# EAGLE design FlightComputer_DeploymentBoard_Rev_B (EAGLE 9.0.1)
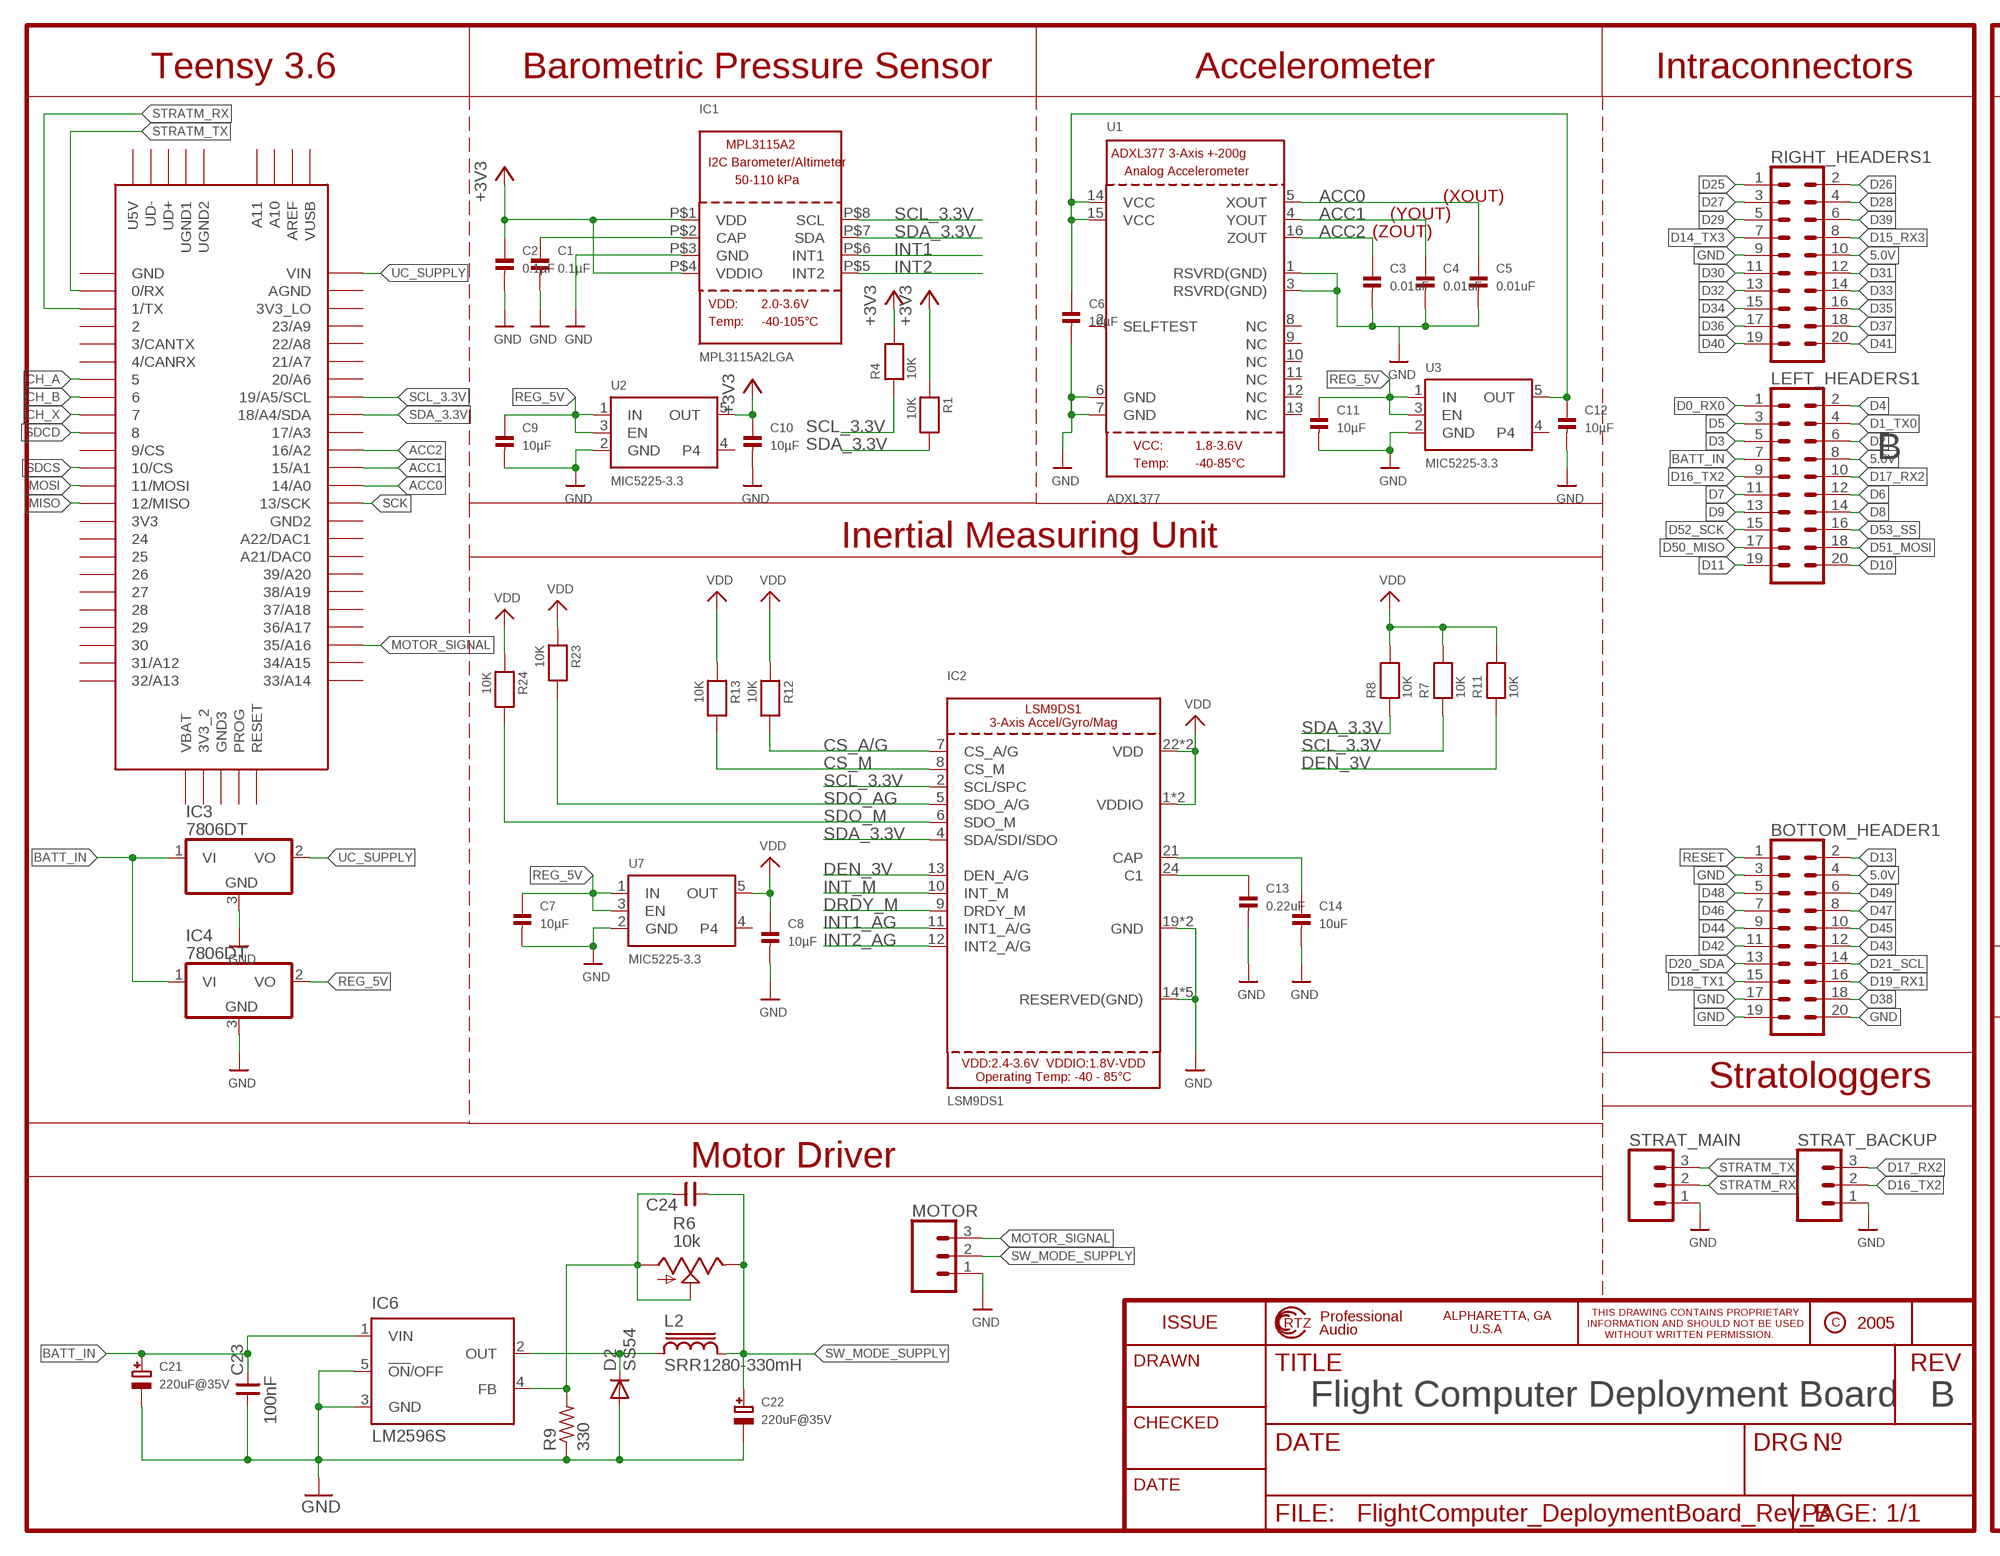
[diagram p0: schematic, sheet 1, part 1 of 2]
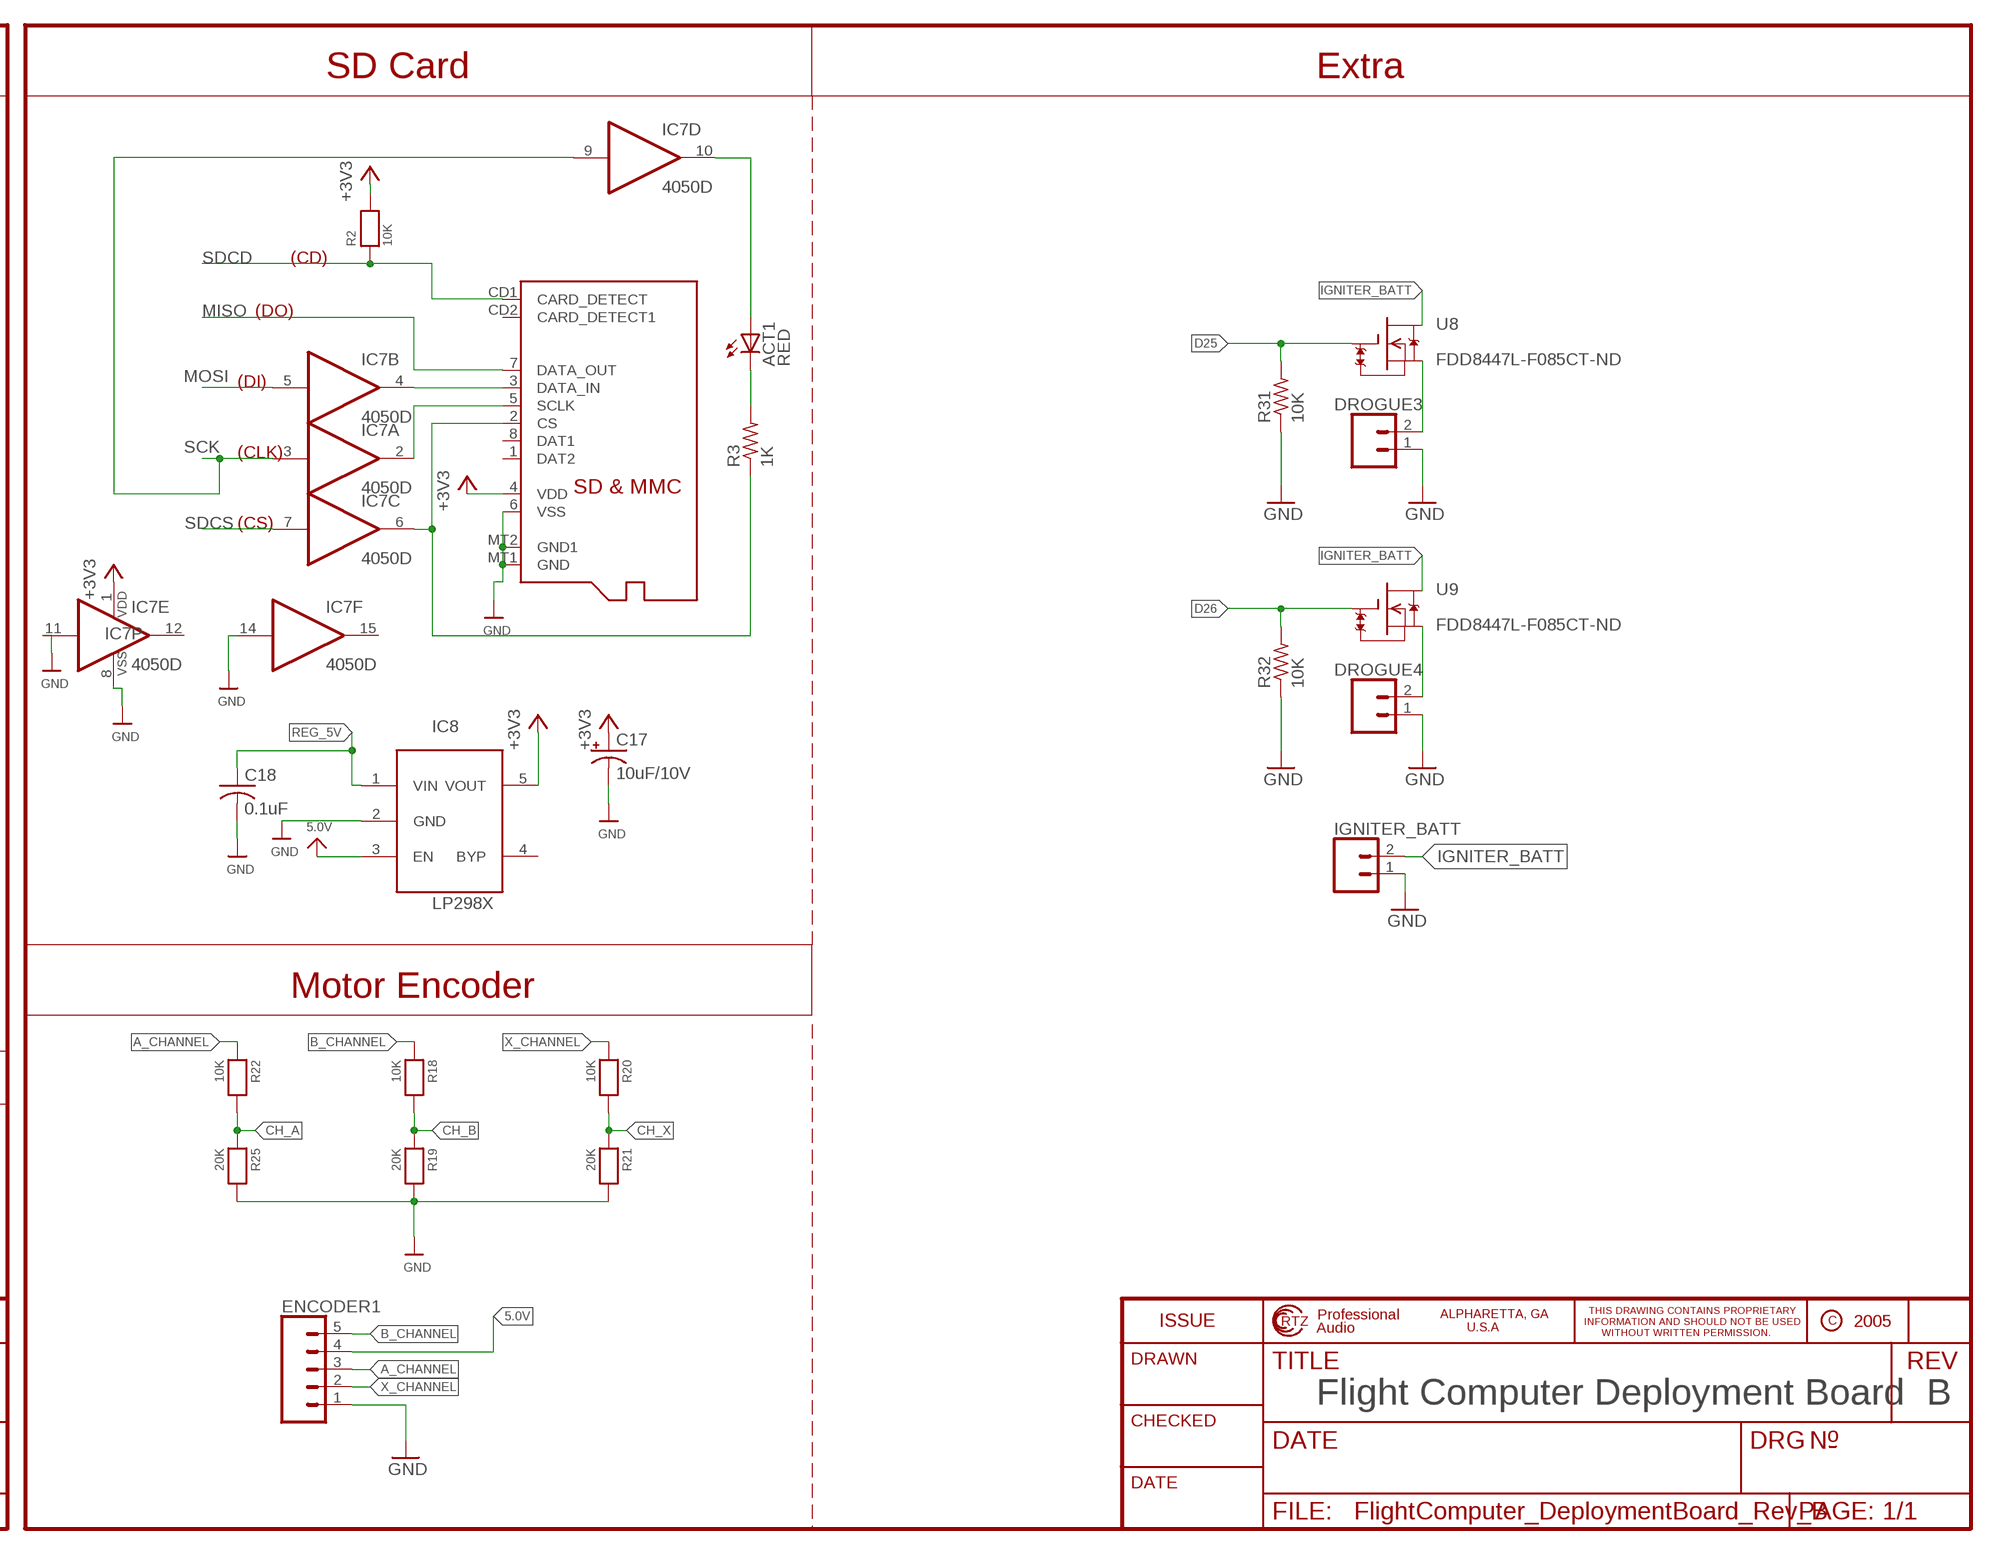
[diagram p1: schematic, sheet 1, part 2 of 2]

## Parts
ACT1  RED  LEDCHIP-LED0805  [CHIP-LED0805]
BOTTOM_HEADER1  CONN_10X2  [2X10]
C1  0.1µF  CAP_CERAMIC0603  [0603]
C2  0.1µF  CAP_CERAMIC0603  [0603]
C3  0.01uF  CAP_CERAMIC0603  [0603]
C4  0.01uF  CAP_CERAMIC0603  [0603]
C5  0.01uF  CAP_CERAMIC0603  [0603]
C6  10µF  CAP_CERAMIC0603  [0603]
C7  10µF  CAP_CERAMIC0603  [0603]
C8  10µF  CAP_CERAMIC0603  [0603]
C9  10µF  CAP_CERAMIC0603  [0603]
C10  10µF  CAP_CERAMIC0603  [0603]
C11  10µF  CAP_CERAMIC0603  [0603]
C12  10µF  CAP_CERAMIC0603  [0603]
C13  0.22uF  CAP_CERAMIC0603  [0603]
C14  10uF  CAP_CERAMIC0603  [0603]
C17  10uF/10V  CPOL-USA/3216-18R  [A/3216-18R]
C18  0.1uF  C-USC0805K  [C0805K]
C21  220uF@35V  CAP_ELECTROLYTICPANASONIC_D  [PANASONIC_D]
C22  220uF@35V  CAP_ELECTROLYTICPANASONIC_D  [PANASONIC_D]
C23  100nF  CNP-0603  [0603]
C24  CNP-0603  [0603]
D2  SS54  S3G  [DO214AB]
DROGUE3  CONN_023.5MM  [SCREWTERMINAL-3.5MM-2]
DROGUE4  CONN_023.5MM  [SCREWTERMINAL-3.5MM-2]
ENCODER1  CONN_05  [1X05]
IC1  MPL3115A2LGA  [LGA8]
IC2  LSM9DS1  [LGA24_3.5X3.1MM]
IC3  7806DT  [TO252]
IC4  7806DT  [TO252]
IC6  LM2596S  [TO263-5]
IC7  4050D  [SO16]
IC8  LP298XS  [SOT23-5L]
IGNITER_BATT  CONN_02  [1X02]
L2  SRR1280-330mH  SRR1280  [SRR1280]
LEFT_HEADERS1  CONN_10X2  [2X10]
MOTOR  CONN_03  [1X03]
R1  10K  RESISTOR0603  [0603]
R2  10K  RESISTOR0603  [0603]
R3  1K  R-US_R0805  [R0805]
R4  10K  RESISTOR0603  [0603]
R6  10k  TRIM_US-S64W  [S64W]
R7  10K  RESISTOR0603  [0603]
R8  10K  RESISTOR0603  [0603]
R9  330  R-US_R0603  [R0603]
R11  10K  RESISTOR0603  [0603]
R12  10K  RESISTOR0603  [0603]
R13  10K  RESISTOR0603  [0603]
R18  10K  RESISTOR0603  [0603]
R19  20K  RESISTOR0603  [0603]
R20  10K  RESISTOR0603  [0603]
R21  20K  RESISTOR0603  [0603]
R22  10K  RESISTOR0603  [0603]
R23  10K  RESISTOR0603  [0603]
R24  10K  RESISTOR0603  [0603]
R25  20K  RESISTOR0603  [0603]
R31  10K  R-US_R0805  [R0805]
R32  10K  R-US_R0805  [R0805]
RIGHT_HEADERS1  CONN_10X2  [2X10]
STRAT_BACKUP  CONN_03  [1X03]
STRAT_MAIN  CONN_03  [1X03]
U1  ADXL377  ACCEL_ADXL377  [LFCSP16_LQ]
U2  MIC5225-3.3  VREG_SOT23-5  [SOT23-5]
U3  MIC5225-3.3  VREG_SOT23-5  [SOT23-5]
U7  MIC5225-3.3  VREG_SOT23-5  [SOT23-5]
U8  FDD8447L-F085CT-ND  TSM4ND50  [TO252]
U9  FDD8447L-F085CT-ND  TSM4ND50  [TO252]
U$1  TEENSY_3.5/3.6  [TEENSY_3.5/3.6]
U$38  STRATOLOGGER  [STRATOLOGGER]
X2  MICROSD  [MICROSD]

## Nets
5.0V: BOTTOM_HEADER1.4 ENCODER1.4 IC8.3(EN) LEFT_HEADERS1.8 RIGHT_HEADERS1.10
+3V3: C2.1 C10.1 C17.+ IC1.P$1(VDD) IC1.P$4(VDDIO) IC7.1(P:VDD) IC8.5(VOUT) R1.1 R2.2 R4.2 U2.5(OUT) X2.4(VDD)
A_CHANNEL: ENCODER1.3 R22.1
ACC0: C5.1 U1.5(XOUT) U$1.14/A0
ACC1: C4.1 U1.4(YOUT) U$1.15/A1
ACC2: C3.1 U1.16(ZOUT) U$1.16/A2
B_CHANNEL: ENCODER1.5 R18.1
BATT_IN: C21.+ C23.2 IC3.1(VI) IC4.1(VI) IC6.1(VIN) LEFT_HEADERS1.7
C1: C13.1 IC2.24(C1)
CAP1: C1.1 IC1.P$2(CAP)
CAP3: C14.1 IC2.21(CAP)
CH_A: R22.2 R25.1 U$1.5
CH_B: R18.2 R19.1 U$1.6
CH_X: R20.2 R21.1 U$1.7
CS_A/G: IC2.7(CS_A/G) R12.2
CS_M: IC2.8(CS_M) R13.2
D0_RX0: LEFT_HEADERS1.1
D1_TX0: LEFT_HEADERS1.4
D2: LEFT_HEADERS1.6
D3: LEFT_HEADERS1.5
D4: LEFT_HEADERS1.2
D5: LEFT_HEADERS1.3
D6: LEFT_HEADERS1.12
D7: LEFT_HEADERS1.11
D8: LEFT_HEADERS1.14
D9: LEFT_HEADERS1.13
D10: LEFT_HEADERS1.20
D11: LEFT_HEADERS1.19
D13: BOTTOM_HEADER1.2
D14_TX3: RIGHT_HEADERS1.7
D15_RX3: RIGHT_HEADERS1.8
D16_TX2: LEFT_HEADERS1.9 STRAT_BACKUP.2
D17_RX2: LEFT_HEADERS1.10 STRAT_BACKUP.3
D18_TX1: BOTTOM_HEADER1.15
D19_RX1: BOTTOM_HEADER1.16
D20_SDA: BOTTOM_HEADER1.13
D21_SCL: BOTTOM_HEADER1.14
D25: R31.2 RIGHT_HEADERS1.1 U8.G
D26: R32.2 RIGHT_HEADERS1.2 U9.G
D27: RIGHT_HEADERS1.3
D28: RIGHT_HEADERS1.4
D29: RIGHT_HEADERS1.5
D30: RIGHT_HEADERS1.11
D31: RIGHT_HEADERS1.12
D32: RIGHT_HEADERS1.13
D33: RIGHT_HEADERS1.14
D34: RIGHT_HEADERS1.15
D35: RIGHT_HEADERS1.16
D36: RIGHT_HEADERS1.17
D37: RIGHT_HEADERS1.18
D38: BOTTOM_HEADER1.18
D39: RIGHT_HEADERS1.6
D40: RIGHT_HEADERS1.19
D41: RIGHT_HEADERS1.20
D42: BOTTOM_HEADER1.11
D43: BOTTOM_HEADER1.12
D44: BOTTOM_HEADER1.9
D45: BOTTOM_HEADER1.10
D46: BOTTOM_HEADER1.7
D47: BOTTOM_HEADER1.8
D48: BOTTOM_HEADER1.5
D49: BOTTOM_HEADER1.6
D50_MISO: LEFT_HEADERS1.17
D51_MOSI: LEFT_HEADERS1.18
D52_SCK: LEFT_HEADERS1.15
D53_SS: LEFT_HEADERS1.16
DEN_3V: IC2.13(DEN_A/G) R11.1
DRDY_M: IC2.9(DRDY_M)
GND: BOTTOM_HEADER1.3 BOTTOM_HEADER1.17 BOTTOM_HEADER1.19 BOTTOM_HEADER1.20 C1.2 C2.2 C3.2 C4.2 C5.2 C6.2 C7.2 C8.2 C9.2 C10.2 C11.2 C12.2 C13.2 C14.2 C17.- C18.2 C21.- C22.- C23.1 D2.A DROGUE3.1 DROGUE4.1 ENCODER1.1 IC1.P$3(GND) IC2.14(RESERVED(GND)) IC2.15(RESERVED(GND)) IC2.16(RESERVED(GND)) IC2.17(RESERVED(GND)) IC2.18(RESERVED(GND)) IC2.19(GND) IC2.20(GND) IC3.3(GND) IC4.3(GND) IC6.3(GND) IC6.5(!ON!/OFF) IC7.8(P:VSS) IC7.11(E:I) IC7.14(F:I) IC8.2(GND) IGNITER_BATT.1 MOTOR.1 R9.1 R19.2 R21.2 R25.2 R31.1 R32.1 RIGHT_HEADERS1.9 STRAT_BACKUP.1 STRAT_MAIN.1 U1.1(RSVRD(GND)) U1.3(RSVRD(GND)) U1.6(GND) U1.7(GND) U2.2(GND) U3.2(GND) U7.2(GND) X2.6(VSS) X2.MT1(GND) X2.MT2(GND1)
IGNITER_BATT: IGNITER_BATT.2 U8.D U9.D
INT1: IC1.P$6(INT1)
INT1_AG: IC2.11(INT1_A/G)
INT2: IC1.P$5(INT2)
INT2_AG: IC2.12(INT2_A/G)
INT_M: IC2.10(INT_M)
MISO: U$1.12/MISO X2.7(DATA_OUT)
MOSI: IC7.5(B:I) U$1.11/MOSI
MOTOR_SIGNAL: MOTOR.3 U$1.35/A16
N$1: ACT1.A IC7.10(D:O)
N$2: IC7.2(A:O) X2.5(SCLK)
N$4: IC7.6(C:O) R3.1 X2.2(CS)
N$5: ACT1.C R3.2
N$6: IC7.4(B:O) X2.3(DATA_IN)
N$8: D2.C IC6.2(OUT) L2.1
N$9: C24.2 IC6.4(FB) R6.A R6.S R9.2
N$36: C6.1 C12.1 U1.14(VCC) U1.15(VCC) U3.5(OUT)
REG_5V: C7.1 C9.1 C11.1 C18.1 IC4.2(VO) IC8.1(VIN) U2.1(IN) U2.3(EN) U3.1(IN) U3.3(EN) U7.1(IN) U7.3(EN)
RESET: BOTTOM_HEADER1.1
SCK: IC7.3(A:I) IC7.9(D:I) U$1.13/SCK
SCL_3.3V: IC1.P$8(SCL) IC2.2(SCL/SPC) R4.1 R7.1 U$1.19/A5/SCL
SDA_3.3V: IC1.P$7(SDA) IC2.4(SDA/SDI/SDO) R1.2 R8.1 U$1.18/A4/SDA
SDCD: R2.1 U$1.8 X2.CD1(CARD_DETECT)
SDCS: IC7.7(C:I) U$1.10/CS
SDO_AG: IC2.5(SDO_A/G) R23.2
SDO_M: IC2.6(SDO_M) R24.2
SOURCE2: DROGUE3.2 U8.S
SOURCE3: DROGUE4.2 U9.S
STRATM_RX: STRAT_MAIN.2 U$1.1/TX
STRATM_TX: STRAT_MAIN.3 U$1.0/RX
SW_MODE_SUPPLY: C22.+ C24.1 L2.2 MOTOR.2 R6.E
UC_SUPPLY: IC3.2(VO) U$1.VIN
VDD: C8.1 IC2.1(VDDIO) IC2.3(VDDIO) IC2.22(VDD) IC2.23(VDD) R7.2 R8.2 R11.2 R12.1 R13.1 R23.1 R24.1 U7.5(OUT)
X_CHANNEL: ENCODER1.2 R20.1
Unconnected: IC7.12(E:O) IC7.15(F:O) IC8.4(BYP) U1.2(SELFTEST) U1.8(NC) U1.9(NC) U1.10(NC) U1.11(NC) U1.12(NC) U1.13(NC) U2.4 U3.4 U7.4 U$1.2 U$1.3/CANTX U$1.3V3 U$1.3V3_2 U$1.3V3_LO U$1.4/CANRX U$1.9/CS U$1.17/A3 U$1.20/A6 U$1.21/A7 U$1.21/DAC0(A21/DAC0) U$1.22/A8 U$1.23/A9 U$1.24 U$1.25 U$1.26 U$1.27 U$1.28 U$1.29 U$1.30 U$1.31/A12 U$1.32/A13 U$1.33/A14 U$1.34/A15 U$1.36/A17 U$1.37/A18 U$1.38/A19 U$1.39/A20 U$1.A10 U$1.A11 U$1.A22/DAC1 U$1.AGND U$1.AREF U$1.GND U$1.GND2 U$1.GND3 U$1.PROG U$1.RESET U$1.U5V U$1.UD+ U$1.UD- U$1.UGND1 U$1.UGND2 U$1.VBAT U$1.VUSB X2.1(DAT2) X2.8(DAT1) X2.CD2(CARD_DETECT1)

## Notes on the sheet
- Teensy 3.6 | Barometric Pressure Sensor | Accelerometer | Intraconnectors | SD Card | Extra
- (XOUT)
- (YOUT)
- (ZOUT)
- (CD)
- (DO)
- (DI)
- B | (CLK)
- (CS)
- Inertial Measuring Unit
- Motor Encoder
- Stratologgers
- Motor Driver
- Flight Computer Deployment Board | B | Flight Computer Deployment Board | B

## Library data of the parts
ACT1 = adafruit:LED: LED OSRAM: - CHIPLED LG R971, LG N971, LY N971, LG Q971, LY Q971, LO R971, LY R971 LH N974, LH R974 LS Q976, LO Q976, LY Q976 LO Q996 - Hyper CHIPLED LW Q18S LB Q993, LB Q99A, LB R99A - SideLED LS A670, LO A670, LY A670, LG A670, LP A670 LB A673, LV A673, LT A673, LW A673 LH A674 LY A675 LS A676, LA A676, LO A676, LY A676, LW A676 LS A679, LY A679, LG A679 - Hyper Micro SIDELED® LS Y876, LA Y876, LO Y876, LY Y876 LT Y87S - SmartLED LW L88C, LW L88S LB L89C, LB L89S, LG L890 LS L89K, LO L89K, LY L89K LS L896, LA L896, LO L896, LY L896 - TOPLED LS T670, LO T670, LY T670, LG T670, LP T670 LSG T670, LSP T670, LSY T670, LOP T670, LYG T670 LG T671, LOG T671, LSG T671 LB T673, LV T673, LT T673, LW T673 LH T674 LS T676, LA T676, LO T676, LY T676, LB T676, LH T676, LSB T676, LW T676 LB T67C, LV T67C, LT T67C, LS T67K, LO T67K, LY T67K, LW E67C LS E67B, LA E67B, LO E67B, LY E67B, LB E67C, LV E67C, LT E67C LW T67C LS T679, LY T679, LG T679 LS T770, LO T770, LY T770, LG T770, LP T770 LB T773, LV T773, LT T773, LW T773 LH T774 LS E675, LA E675, LY E675, LS T675 LS T776, LA T776, LO T776, LY T776, LB T776 LHGB T686 LT T68C, LB T68C - Hyper Mini TOPLED® LB M676 - Mini TOPLED Santana® LG M470 LS M47K, LO M47K, LY M47K Source: http://www.osram.convergy.de/
BOTTOM_HEADER1 LEFT_HEADERS1 RIGHT_HEADERS1 = SparkFun-Connectors:CONN_10X2: Multi connection point. Often used as Generic Header-pin footprint for 0.1 inch spaced/style header connections On any of the 0.1 inch spaced packages, you can populate with these: Break Away Headers - Straight <https://www.sparkfun.com/products/116> (PRT-00116) Break Away Male Headers - Right Angle <https://www.sparkfun.com/products/553> (PRT-00553) Female Headers <https://www.sparkfun.com/products/115> (PRT-00115) Break Away Headers - Machine Pin <https://www.sparkfun.com/products/117> (PRT-00117) Break Away Female Headers - Swiss Machine Pin <https://www.sparkfun.com/products/743> (PRT-00743) Special note about the "SPECIAL" package: This was SPECIALLY designed to be used with our Graphic LCD Backpack. Be sure you want to use this! It is not only staggered on each line of header holes, but IT IS ALSO offset of the center point of the top and bottom lines by 5 mil. This causes the headers to lock into place on the "standard" footprint on the LCD screen. The extra squares on the tdocu layer are there simply to reference other pins (if you were to actually populate a longer header than ten long - this is what we do with the backpacks).
C1-C14 = microbuilder:CAP_CERAMIC: Ceramic Capacitors 0402 - 0402 Surface Mount Capacitors 16pF 50V 5% [Digikey: 445-4899-2-ND] 18pF 50V 5% [Digikey: 490-1281-2-ND] 22pF 50V 5% [Digikey: 490-1283-2-ND] 68pF 50V 5% [Digikey: 490-1289-2-ND] 0.1uF 10V 10% [Digikey: 490-1318-2-ND] 1.0uF 6.3V 10% [Digikey: 490-1320-2-ND] 0603 - 0603 Surface Mount Capacitors 16 pF 50V 5% [Digikey: 445-5051-2-ND] 22 pF 50V [Digikey: PCC220ACVTR-ND] 33 pF 50V 5% [Digikey: 490-1415-1-ND] 56pF 50V 5% [Digikey: 490-1421-1-ND] 220pF 50V 5% [Digikey: 445-1285-1-ND] 680 pF 50V 2200 pF 50V 5% C0G [Digikey: 445-1297-1-ND] 5600 pF 100V 5% X7R [Digikey: 478-3711-1-ND] 0.1 µF 25V 10% [Digikey: PCC2277TR-ND] 0.22 µF 16V 10% X7R [Digikey: 445-1318-1-ND] 1.0 µF 25V 10% [Digikey: 445-5146-2-ND] 0603 - RF Specific 3pF 250V +/-0.1pF RF [Digikey: 712-1347-1-ND] 18 pF 250V 5% [Digikey: 478-3505-1-ND or 712-1322-1-ND] 56 pF 250V 5% C0G RF [Digikey: 490-4867-1-ND] 68 pF 250V RF [Digikey: 490-4868-1-ND] 0805 - 0805 Surface Mount Capacitors 220 pF 250V 2% RF Ceramic Capacitor [Digikey: 712-1398-1-ND] 1000 pF 50V 2% NP0 Ceramic Capacitor [Digikey: 478-3760-1-ND] 0.1 µF 25V 10% Ceramic Capacitor [Digikey: PCC1828TR-ND] 1.0 µF 16V 10% Ceramic Capacitor[Digikey: 490-1691-2-ND] 10.0 µF 10V 10% Ceramic Capacitor[Digikey: 709-1228-1-ND] 10.0 uF 16V 10% Ceramic Capacitor [Digikey: 478-5165-2-ND] 47 uF 6.3V 20% Ceramic Capacitor [Digikey: 587-1779-1-ND or 399-5506-1-ND] 1206 - 1206 Surface Mount Capacitors 47uF 10V 20% Ceramic Capacitor [Digikey: 490-5528-1-ND or 399-5508-1-ND or 445-6010-1-ND]
C17 = adafruit:CPOL-US: POLARIZED CAPACITOR, American symbol
C18 = adafruit:C-US: CAPACITOR, American symbol
C21 C22 = microbuilder:CAP_ELECTROLYTIC: Electrolytic Capacitors PANASONIC_C - Size C Panasonic Electrolytic Aluminum Capacitor 47µF 16V 20% Electrolytic Capacitor [Digikey: PCE3890TR-ND] PANASONIC_D - Size D Panasonic Electrolytic Aluminum Capacitor 100µF 25V 20% Electrolytic Capacitor [Digikey: PCE3898TR-ND]
C23 C24 = cap-master:CNP-: NON-POLARIZED CAP
D2 = s3x_10:S3*: S3A - S3N General Purpose Rectifiers Source: http://www.fairchildsemi.com/datasheets/S3/S3A.pdf; MF: Fairchild; MPN: S3G; OC_FARNELL: 2454094; OC_NEWARK: 58K2397
DROGUE3 DROGUE4 = SparkFun-Connectors:CONN_02: Multi connection point. Often used as Generic Header-pin footprint for 0.1 inch spaced/style header connections On any of the 0.1 inch spaced packages, you can populate with these: Break Away Headers - Straight <https://www.sparkfun.com/products/116> (PRT-00116) Break Away Male Headers - Right Angle <https://www.sparkfun.com/products/553> (PRT-00553) Female Headers <https://www.sparkfun.com/products/115> (PRT-00115) Break Away Headers - Machine Pin <https://www.sparkfun.com/products/117> (PRT-00117) Break Away Female Headers - Swiss Machine Pin <https://www.sparkfun.com/products/743> (PRT-00743) For SCREWTERMINALS and SPRING TERMINALS visit here: Screw Terimnals on SparkFun.com <https://www.sparkfun.com/search/results?term=Screw+Terminals> (5mm/3.5mm/2.54mm spacing) This device is also useful as a general connection point to wire up your design to another part of your project. Our various solder wires solder well into these plated through hole pads. Hook-Up Wire - Assortment (Stranded, 22 AWG) <https://www.sparkfun.com/products/11375> (PRT-11375) Hook-Up Wire - Assortment (Solid Core, 22 AWG) <https://www.sparkfun.com/products/11367> (PRT-11367) View the entire wire category on our website here <https://www.sparkfun.com/categories/141> Special notes: Molex polarized connector foot print use with: PRT-08233 with associated crimp pins and housings. 2.54_SCREWTERM for use with PRT-10571. 3.5mm Screw Terminal footprints for PRT-08084 5mm Screw Terminal footprints for use with PRT-08432; PROD_ID: CONN-08399
ENCODER1 = SparkFun-Connectors:CONN_05: Multi connection point. Often used as Generic Header-pin footprint for 0.1 inch spaced/style header connections On any of the 0.1 inch spaced packages, you can populate with these: Break Away Headers - Straight <https://www.sparkfun.com/products/116> (PRT-00116) Break Away Male Headers - Right Angle <https://www.sparkfun.com/products/553> (PRT-00553) Female Headers <https://www.sparkfun.com/products/115> (PRT-00115) Break Away Headers - Machine Pin <https://www.sparkfun.com/products/117> (PRT-00117) Break Away Female Headers - Swiss Machine Pin <https://www.sparkfun.com/products/743> (PRT-00743) For SCREWTERMINALS and SPRING TERMINALS visit here: Screw Terimnals on SparkFun.com <https://www.sparkfun.com/search/results?term=Screw+Terminals> (5mm/3.5mm/2.54mm spacing) This device is also useful as a general connection point to wire up your design to another part of your project. Our various solder wires solder well into these plated through hole pads. Hook-Up Wire - Assortment (Stranded, 22 AWG) <https://www.sparkfun.com/products/11375> (PRT-11375) Hook-Up Wire - Assortment (Solid Core, 22 AWG) <https://www.sparkfun.com/products/11367> (PRT-11367) View the entire wire category on our website here <https://www.sparkfun.com/categories/141> Special notes: Molex polarized connector foot print use with SKU : PRT-08231 with associated crimp pins and housings. 1MM SMD Version SKU: PRT-10208
IC1 = microbuilder:MPL3115A2
IC2 = microbuilder:LSM9DS1
IC3 IC4 = adafruit:78*: Positive VOLTAGE REGULATOR Added bigger pads to the TO-92 package
IC6 = national-semiconductor:LM2596: SIMPLE SWITCHER® Power Converter 150 kHz 3A Step-Down Voltage Regulator Source: http://www.national.com/ds/LM/LM2596.pdf; MF: NATIONAL SEMICONDUCTOR; MPN: LM2596S-ADJ/NOPB; OC_FARNELL: 9494367; OC_NEWARK: 41K3842
IC7 = 40xx:4050: Hex non-inverting BUFFER
IC8 = adafruit:LP298X
IGNITER_BATT = SparkFun-Connectors:CONN_02: Multi connection point. Often used as Generic Header-pin footprint for 0.1 inch spaced/style header connections On any of the 0.1 inch spaced packages, you can populate with these: Break Away Headers - Straight <https://www.sparkfun.com/products/116> (PRT-00116) Break Away Male Headers - Right Angle <https://www.sparkfun.com/products/553> (PRT-00553) Female Headers <https://www.sparkfun.com/products/115> (PRT-00115) Break Away Headers - Machine Pin <https://www.sparkfun.com/products/117> (PRT-00117) Break Away Female Headers - Swiss Machine Pin <https://www.sparkfun.com/products/743> (PRT-00743) For SCREWTERMINALS and SPRING TERMINALS visit here: Screw Terimnals on SparkFun.com <https://www.sparkfun.com/search/results?term=Screw+Terminals> (5mm/3.5mm/2.54mm spacing) This device is also useful as a general connection point to wire up your design to another part of your project. Our various solder wires solder well into these plated through hole pads. Hook-Up Wire - Assortment (Stranded, 22 AWG) <https://www.sparkfun.com/products/11375> (PRT-11375) Hook-Up Wire - Assortment (Solid Core, 22 AWG) <https://www.sparkfun.com/products/11367> (PRT-11367) View the entire wire category on our website here <https://www.sparkfun.com/categories/141> Special notes: Molex polarized connector foot print use with: PRT-08233 with associated crimp pins and housings. 2.54_SCREWTERM for use with PRT-10571. 3.5mm Screw Terminal footprints for PRT-08084 5mm Screw Terminal footprints for use with PRT-08432
L2 = inductor-bourns:SRR1280: POWER INDUCTOR
MOTOR STRAT_BACKUP STRAT_MAIN = SparkFun-Connectors:CONN_03: Multi connection point. Often used as Generic Header-pin footprint for 0.1 inch spaced/style header connections On any of the 0.1 inch spaced packages, you can populate with these: Break Away Headers - Straight <https://www.sparkfun.com/products/116> (PRT-00116) Break Away Male Headers - Right Angle <https://www.sparkfun.com/products/553> (PRT-00553) Female Headers <https://www.sparkfun.com/products/115> (PRT-00115) Break Away Headers - Machine Pin <https://www.sparkfun.com/products/117> (PRT-00117) Break Away Female Headers - Swiss Machine Pin <https://www.sparkfun.com/products/743> (PRT-00743) Stackable Header - 3 Pin (Female, 0.1") <https://www.sparkfun.com/products/13875> (PRT-13875) For SCREWTERMINALS and SPRING TERMINALS visit here: Screw Terimnals on SparkFun.com <https://www.sparkfun.com/search/results?term=Screw+Terminals> (5mm/3.5mm/2.54mm spacing) This device is also useful as a general connection point to wire up your design to another part of your project. Our various solder wires solder well into these plated through hole pads. Hook-Up Wire - Assortment (Stranded, 22 AWG) <https://www.sparkfun.com/products/11375> (PRT-11375) Hook-Up Wire - Assortment (Solid Core, 22 AWG) <https://www.sparkfun.com/products/11367> (PRT-11367) View the entire wire category on our website here <https://www.sparkfun.com/categories/141> Special notes: Molex polarized connector foot print use with SKU : PRT-08232 with associated crimp pins and housings.
R1 R2 R4 R7 R8 R11-R13 R18-R25 = microbuilder:RESISTOR: Resistors 0402 - 0402 Surface Mount Package 22 Ohm 1% 1/16W [Digikey: 311-22.0LRTR-ND] 33 Ohm 5% 1/16W 1.0K 5% 1/16W 1.5K 5% 1/16W 2.0K 1% 1/16W 10.0K 1% 1/16W [Digikey: 311-10.0KLRTR-ND] 10.0K 5% 1/16W [Digikey: RMCF0402JT10K0TR-ND] 12.1K 1% 1/16W [Digikey: 311-22.0LRTR-ND] 100.0K 5% 1/16W 0603 - 0603 Surface Mount Package 0 Ohm 1/10 Watt 1% Resistor 15 Ohm 1/10 Watt 1% Resistor 33 Ohm 1/10 Watt 1% Resistor 49.9 Ohm 1/10 Watt 1% Resistor 100 Ohm 1/10 Watt 1% Resistor 150 Ohm 1/10 Watt 1% Resistor 240 Ohm 1/10 Watt 1% Resistor 390 Ohm 1/10 Watt 1% Resistor 560 Ohm 1/10 Watt 1% Resistor 680 Ohm 1/10 Watt 1% Resistor 750 Ohm 1/10 Watt 1% Resistor 1.0K Ohm 1/10 Watt 1% Resistor 1.5K Ohm 1/10 Watt 1% Resistor 2.0K Ohm 1/10 Watt 1% Resistor 2.2K Ohm 1/10 Watt 1% Resistor 3.3K Ohm 1/10 Watt 1% Resistor 4.7K Ohm 1/10 Watt 1% Resistor 10.0K Ohm 1/10 Watt 1% Resistor 12.0K Ohm 1/10 Watt 1% Resistor 12.1K Ohm 1/10 Watt 1% Resistor 20.0K Ohm 1/10 Watt 1% Resistor 33.0K Ohm 1/10 Watt 1% Resistor 100.0K Ohm 1/10 Watt 1% Resistor 0805 - 0805 Surface Mount Package 0 Ohm 1/8 Watt 1% Resistor 33 Ohm 1/8 Watt 1% Resistor 100 Ohm 1/8 Watt 1% Resistor 150 Ohm 1/8 Watt 1% Resistor 200 Ohm 1/8 Watt 1% Resistor 240 Ohm 1/8 Watt 1% Resistor 330 Ohm 1/8 Watt 1% Resistor 390 Ohm 1/8 Watt 1% Resistor 470 Ohm 1/8 Watt 1% Resistor 1.0K Ohm 1/8 Watt 1% Resistor 1.5K Ohm 1/8 Watt 1% Resistor 2.0K Ohm 1/8 Watt 1% Resistor 4.7K Ohm 1/8 Watt 1% Resistor 5.1K Ohm 1/8 Watt 1% Resistor 5.6K Ohm 1/8 Watt 1% Resistor 10.0K Ohm 1/8 Watt 1% Resistor 22.0K Ohm 1/8 Watt 1% Resistor 33.0K Ohm 1/8 Watt 1% Resistor 100K Ohm 1/8 Watt 1% Resistor 1206 - 1206 Surface Mount Package 2012 - 2010 Surface Mount Package 0.11 Ohm 1/2 Watt 1% Resistor - Digikey: RHM.11UCT-ND
R3 R9 R31 R32 = adafruit:R-US_: RESISTOR, American symbol
R6 = pot:TRIM_US-: POTENTIOMETER
U1 = microbuilder:ACCEL_ADXL377: ADXL377 +/-200g 3-Axis Analog Accelerometer VCC: 1.8-3.6V
U2 U3 U7 = microbuilder:VREG_SOT23-5: SOT23-5 Fixed Voltage Regulators Part Current Out V Out V In V Dropout θJA (°C/W) TJ (°C) Digikey Part No. ADP121 150mA 3.3V 3.4-5.5V 0.09V @ 150mA -- -- ADP121-AUJZ33R7CT-ND ADP121 150mA 3.0V 3.1-5.5V 0.09V @ 150mA -- -- ADP121-AUJZ30R7CT-ND ADP122 300mA 3.3V 3.4-5.5V 0.085V @ 300mA -- -- ADP122AUJZ-3.3-R7CT-ND ADP1712 300mA 3.3V 3.5-5.5V 0.17V @ 300mA -- -- ADP1712AUJZ-3.3-R7TR-ND AP7311 (Low Cost) 150mA 3.3V 3.5-6V 0.15V @ 150mA -- -- AP7311-33WG-7DICT-ND LD39015M18R 150mA 1.8V 1.9V-5.5V 0.08V @ 100mA -- -- 497-6977-1-ND LP2985A-33DBVR 150mA 3.3V 3.3-16V 0.28V @ 150mA 206 150 296-18479-1-ND MCP1824T-3302E/OT 300mA 3.3V 3.5V-6V 0.2V @ 300mA -- -- MCP1824T-3302E/OTCT-ND MIC5205-2.5YM5 TR 150mA 2.5V 2.7-16V 0.165V @ 150mA -- -- 576-1257-2-ND MIC5205-3.0YM5 TR 150mA 3.0V 3.2V-16V 0.165V @ 150mA -- -- 576-1258-2-ND MIC5205-3.3YM5 TR 150mA 3.3V 3.5V-16V 0.165V @ 150mA -- -- 576-1259-2-ND TPS780330220 150mA 3.3V+2.2V 3.6-5.5V 250mV Max -- -- 296-23332-1-ND TDA3663/N1,135 100mA 3.3V 3.5-45V 0.18V @ 50mA -- -- 568-5343-1-ND Max operating temp can be calculated using θJA, TJ (max junction temperature), and power in watts. Set the "Maximum Ambient Temperature" until it reaches TJ ("Max Junction Temperature"), which is the absolute limit for safe use of the regulator: Heat Sink Temperature Calculator <http://www.daycounter.com/Calculators/Heat-Sink-Temperature-Calculator.phtml> For example, With 12V source into a 3.3V LP2985 and a 30mA load, we are dissipating (12V-3.3V) * 0.03A = 0.261W. With a θJA of 206 °C/W, a TJ of 150°C, and 261mW we can safely use the chip without a heat sink up to 75°C (=147.1°C Junction Temperature).
U8 U9 = TSM4ND50:TSM4ND50: MOSFET,N CH,500V,3A,TO252 Transistor Polarity: N Channel Continuous Drain Current Id: 3A Drain Source Voltage Vds: 500V On Resistance Rds(on): 2.3ohm Rds(on) Test Voltage Vgs: 10V Power Dissipation Pd: 45W Operating Temperature Range: -55°C to +150°C Transistor Case Style: TO-252 No. of Pins: 3 SVHC: No SVHC (18-Jun-2012) Power Dissipation Pd: 45W Voltage Vgs Max: 30V
U$1 = Teensy356:TEENSY_3.5/3.6
U$38 = LRA_FlightCPU_Components:STRATOLOGGER
X2 = adafruit:MICROSD: Micro-SD / Transflash card holder with SPI pinout For the 3M # 2908-05WB-MG and/or 4UCON #19656 push-push type

## Board
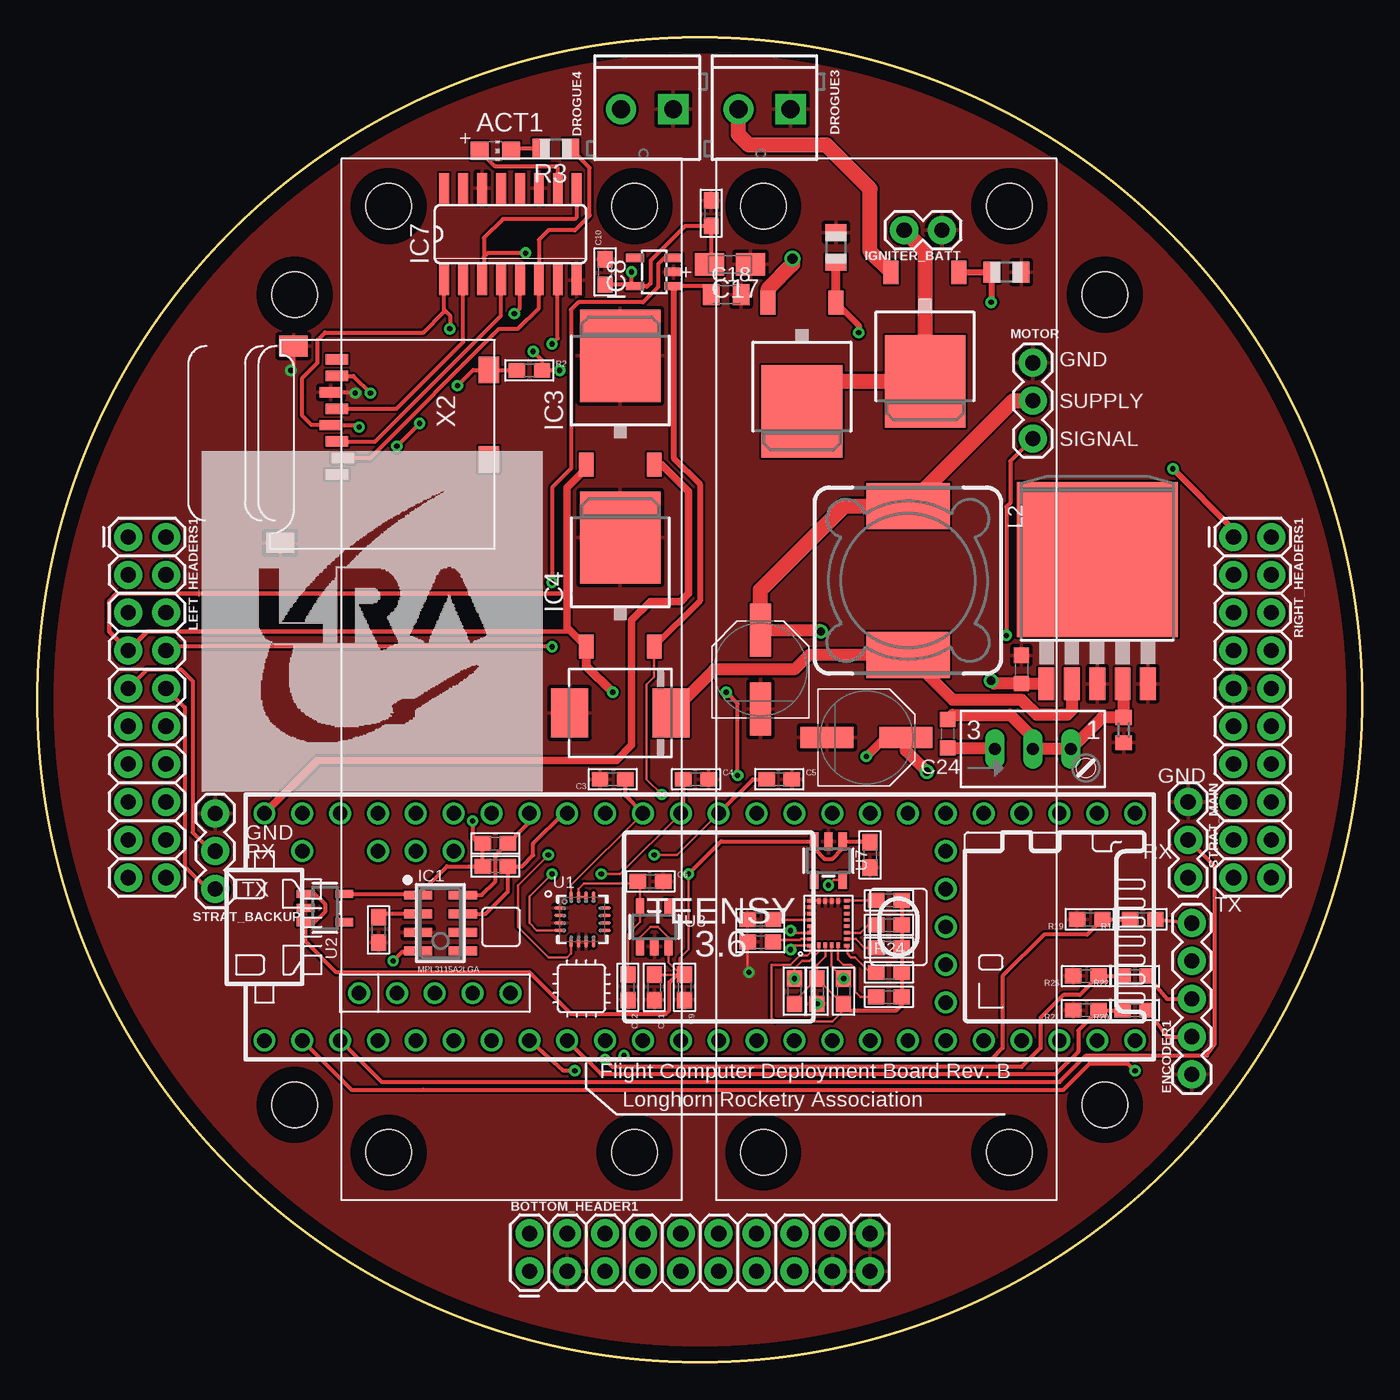
[diagram p2: board, top side]
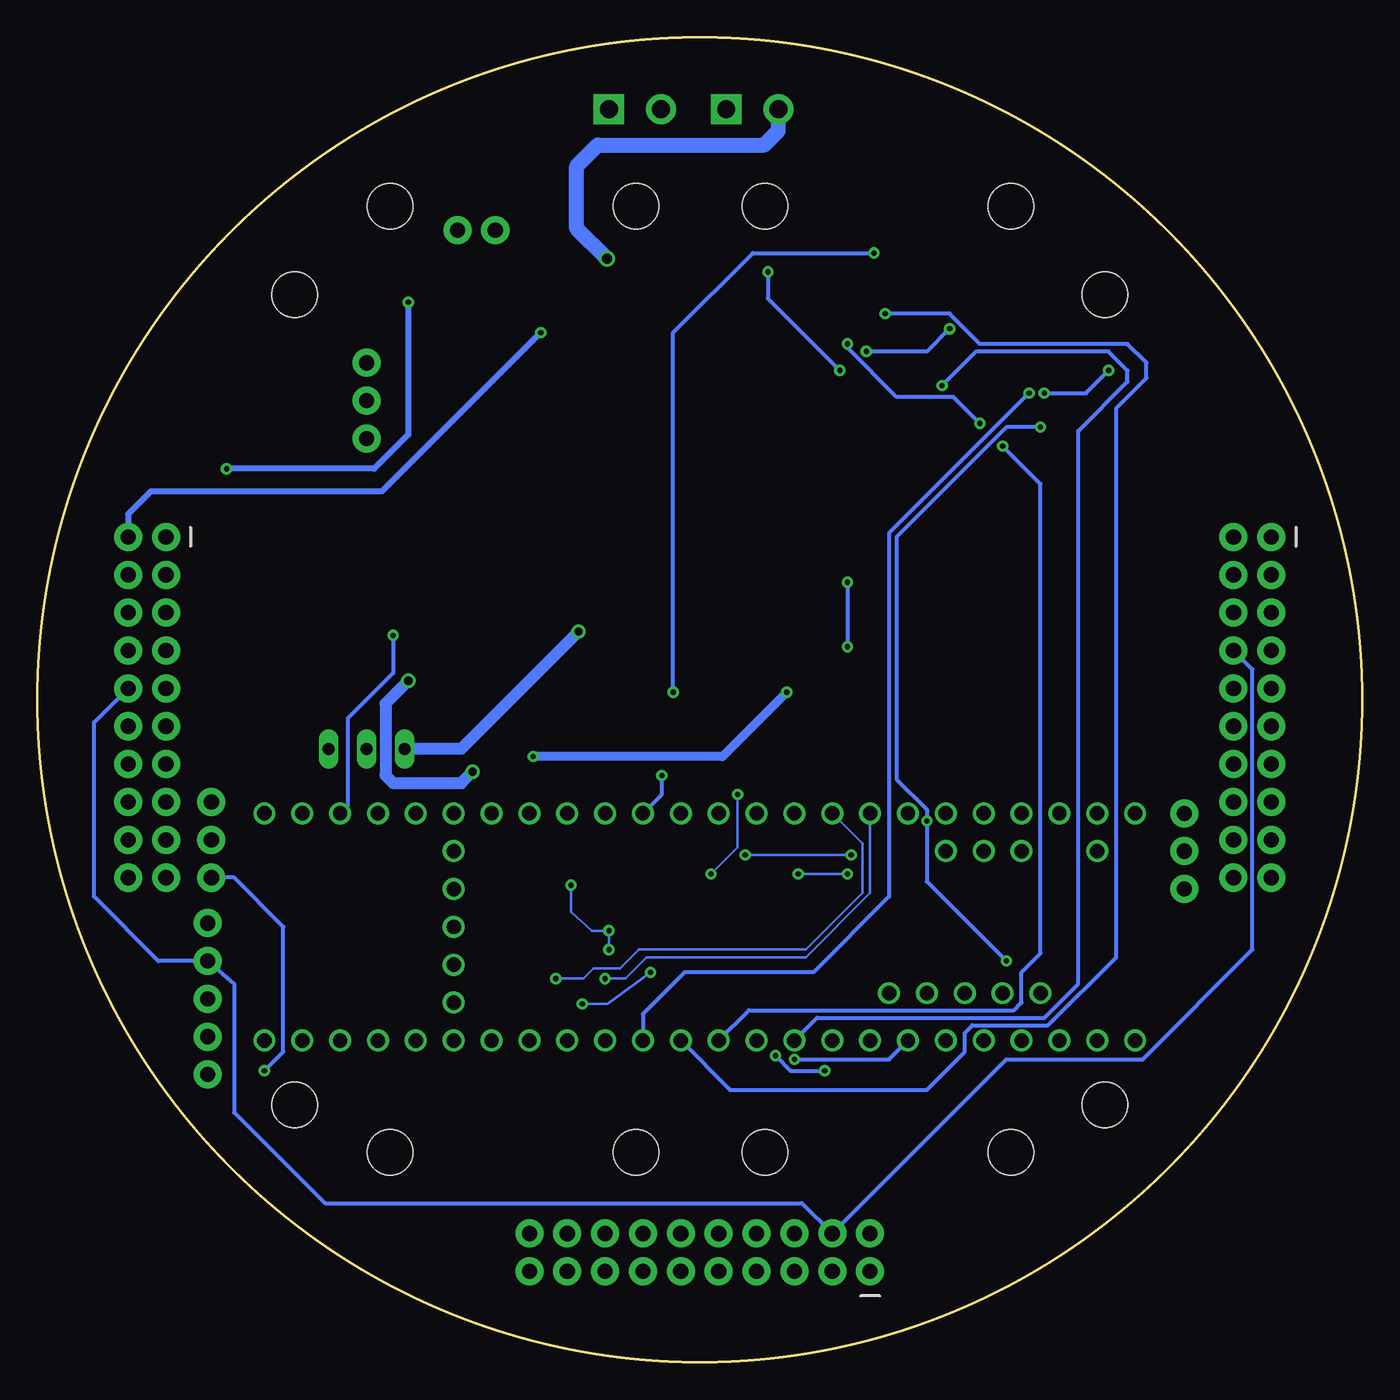
[diagram p3: board, bottom side, seen from below]

Size 88.9 x 88.9 mm. Coordinates in mm from the lower left corner, seen from the top.
Outline: circle at 44.45,44.45 radius 44.45
Copper layers (1*16): Top 0.035mm / dielectric 1.5mm / Bottom 0.035mm
Design rules "default": minimum track width 6mil, minimum drill 0.35mm, track to track 6mil, track to pad 6mil, pad to pad 6mil, via to via 6mil, smd to smd 6mil, copper to edge 40mil, drill to drill 6mil, minimum pad ring 10mil, minimum via ring 8mil, stop-mask expansion 4mil, vias tented up to drill 0mil, thermal gap 10mil
Holes 3.07 mm at 71.63,17.27 71.63,71.63 17.27,17.27 17.27,71.63

### Footprints (pad centres in the part's own frame; a part is rotated, then mirrored left to right if it is on the bottom)
CHIP-LED0805 = smd 1.2 x 1.2: A 0,-1.05; C 0,1.05
2X10 = drill 1.016 pad 1.88: 1 0,0; 2 0,2.54; 3 2.54,0; 4 2.54,2.54; 5 5.08,0; 6 5.08,2.54; 7 7.62,0; 8 7.62,2.54; 9 10.16,0; 10 10.16,2.54; 11 12.7,0; 12 12.7,2.54; 13 15.24,0; 14 15.24,2.54; 15 17.78,0; 16 17.78,2.54; 17 20.32,0; 18 20.32,2.54; 19 22.86,0; 20 22.86,2.54
0603 = smd 1.1 x 1: 1 -0.85,0; 2 0.85,0
A/3216-18R = smd 1.95 x 1.5: + 1.375,0; - -1.375,0
C0805K = smd 1.1 x 1.4: 1 -1,0; 2 1,0
PANASONIC_D = smd 3.556 x 1.4: + 2.654,0; - -2.654,0
0603' = smd 1.016 x 1.016: 1 -0.953,0; 2 0.953,0
DO214AB = smd 2.5 x 3.3: A 3.4,0; C -3.4,0
SCREWTERMINAL-3.5MM-2 = drill 1.2 pad 2.032 square: 1 0,0 | drill 1.2 pad 2.032: 2 3.5,0
1X05 = drill 1.016 pad 1.88: 1 0,0; 2 2.54,0; 3 5.08,0; 4 7.62,0; 5 10.16,0
LGA8 = smd 1.9 x 0.6: P$1 -1.5,1.875; P$2 -1.5,0.625; P$3 -1.5,-0.625; P$4 -1.5,-1.875; P$5 1.5,-1.875; P$6 1.5,-0.625; P$7 1.5,0.625; P$8 1.5,1.875
LGA24_3.5X3.1MM = smd 0.23 x 0.35: 1 -1.505,1.22; 6 -1.505,-1.22; 7 -1.075,-1.22; 8 -0.645,-1.22; 9 -0.215,-1.22; 10 0.215,-1.22; 11 0.645,-1.22; 12 1.075,-1.22; 13 1.505,-1.22; 18 1.505,1.22; 19 1.075,1.22; 20 0.645,1.22; 21 0.215,1.22; 22 -0.215,1.22; 23 -0.645,1.22; 24 -1.075,1.22 | smd 0.35 x 0.23: 2 -1.475,0.645; 3 -1.475,0.215; 4 -1.475,-0.215; 5 -1.475,-0.645; 14 1.475,-0.645; 15 1.475,-0.215; 16 1.475,0.215; 17 1.475,0.645
TO252 = smd 1 x 1.6: 1 -2.28,-4.8; 2 2.28,-4.8 | smd 5.4 x 6.2: 3 0,2.5
TO263-5 = smd 1.067 x 2.159: 1 -3.404,-5.791; 2 -1.702,-5.791; 3 0,-5.791; 4 1.702,-5.791; 5 3.404,-5.791 | smd 10.8 x 10.41: 6 0,2.54
SO16 = smd 0.66 x 2.032: 1 -4.445,-3.073; 2 -3.175,-3.073; 3 -1.905,-3.073; 4 -0.635,-3.073; 5 0.635,-3.073; 6 1.905,-3.073; 7 3.175,-3.073; 8 4.445,-3.073; 9 4.445,3.073; 10 3.175,3.073; 11 1.905,3.073; 12 0.635,3.073; 13 -0.635,3.073; 14 -1.905,3.073; 15 -3.175,3.073; 16 -4.445,3.073
SOT23-5L = smd 0.55 x 1.2: 1 -0.95,-1.3; 2 0,-1.3; 3 0.95,-1.3; 4 0.95,1.3; 5 -0.95,1.3
1X02 = drill 1.016 pad 1.88: 1 0,0; 2 2.54,0
SRR1280 = smd 5.6 x 3.1: 1 0.635,5; 2 0.635,-5
1X03 = drill 1.016 pad 1.88: 1 0,0; 2 2.54,0; 3 5.08,0
R0805 = smd 1.1 x 1.4: 1 -1,0; 2 1,0
S64W = drill 0.813 long: A 2.54,1.27; E -2.54,1.27; S 0,1.27
R0603 = smd 1 x 1.1: 1 -0.85,0; 2 0.85,0
LFCSP16_LQ = smd 0.8 x 0.25: 1 -1.5,0.75; 2 -1.5,0.25; 3 -1.5,-0.25; 4 -1.5,-0.75; 9 1.5,-0.75; 10 1.5,-0.25; 11 1.5,0.25; 12 1.5,0.75 | smd 0.25 x 0.8: 5 -0.75,-1.5; 6 -0.25,-1.5; 7 0.25,-1.5; 8 0.75,-1.5; 13 0.75,1.5; 14 0.25,1.5; 15 -0.25,1.5; 16 -0.75,1.5
SOT23-5 = smd 0.55 x 1.2: 1 -0.95,-1.3; 2 0,-1.3; 3 0.95,-1.3; 4 0.95,1.3; 5 -0.95,1.3
TO252' = smd 5.4 x 6.2: D 0,1.23 | smd 1 x 1.6: G -2.28,-6.07; S 2.28,-6.07
TEENSY_3.5/3.6 = drill 0.965: 0/RX -25.4,-7.62; 1/TX -22.86,-7.62; 2 -20.32,-7.62; 3/CANTX -17.78,-7.62; 3V3 7.62,-7.62; 3V3_2 17.78,-2.54; 3V3_LO -22.86,7.62; 4/CANRX -15.24,-7.62; 5 -12.7,-7.62; 6 -10.16,-7.62; 7 -7.62,-7.62; 8 -5.08,-7.62; 9/CS -2.54,-7.62; 10/CS 0,-7.62; 11/MOSI 2.54,-7.62; 12/MISO 5.08,-7.62; 13/SCK 5.08,7.62; 14/A0 2.54,7.62; 15/A1 0,7.62; 16/A2 -2.54,7.62; 17/A3 -5.08,7.62; 18/A4/SDA -7.62,7.62; 19/A5/SCL -10.16,7.62; 20/A6 -12.7,7.62; 21/A7 -15.24,7.62; 21/DAC0 12.7,7.62; 22/A8 -17.78,7.62; 23/A9 -20.32,7.62; 24 10.16,-7.62; 25 12.7,-7.62; 26 15.24,-7.62; 27 17.78,-7.62; 28 20.32,-7.62; 29 22.86,-7.62; 30 25.4,-7.62; 31/A12 27.94,-7.62; 32/A13 30.48,-7.62; 33/A14 30.48,7.62; 34/A15 27.94,7.62; 35/A16 25.4,7.62; 36/A17 22.86,7.62; 37/A18 20.32,7.62; 38/A19 17.78,7.62; 39/A20 15.24,7.62; A10 -17.78,5.08; A11 -15.24,5.08; A22/DAC1 10.16,7.62; AGND -25.4,7.62; AREF -20.32,5.08; GND -27.94,-7.62; GND2 7.62,7.62; GND3 17.78,0; PROG 17.78,2.54; RESET 17.78,5.08; U5V -21.59,-4.445; UD+ -16.51,-4.445; UD- -19.05,-4.445; UGND1 -13.97,-4.445; UGND2 -11.43,-4.445; VBAT 17.78,-5.08; VIN -27.94,7.62; VUSB -25.4,5.08
STRATOLOGGER = hole 3.048: -3.175,3.175; -3.175,19.685; -66.675,19.685; -66.675,3.175
MICROSD = smd 0.7 x 1.5: 1 9,-10.64; 2 7.9,-10.24; 3 6.8,-10.64; 4 5.7,-11.04; 5 4.6,-10.64; 6 3.5,-11.04; 7 2.4,-10.64; 8 1.3,-10.64 | smd 1.8 x 1.4: CD1 2,-0.44; CD2 8,-0.44 | smd 1.4 x 1.9: MT1 0.4,-13.54; MT2 13.6,-14.44

### Placement (x,y rotation side)
ACT1  30.73,81.28 270 top
BOTTOM_HEADER1  33.02,6.1 0 top
C1  22.89,29 270 top
C2  45.22,77.09 90 top
C3  38.61,39.12 180 top
C4  44.2,39.12 0 top
C5  49.78,39.12 0 top
C6  41.15,32.26 0 top
C7  55.88,34.04 270 top
C8  52.32,24.89 270 top
C9  43.43,25.15 270 top
C10  38.1,73.15 90 top
C11  41.4,25.15 270 top
C12  39.62,25.15 270 top
C13  48.51,28.19 180 top
C14  48.51,29.72 180 top
C17  46.48,73.66 180 top
C18  46.23,71.63 0 top
C21  55.63,41.91 0 top
C22  48.51,46.48 90 top
C23  100nF  [0603']  66.04,46.48 270 top
C24  [0603']  61.09,42.16 90 top
D2  39.12,43.56 180 top
DROGUE3  50.55,84.07 180 top
DROGUE4  42.67,84.07 180 top
ENCODER1  77.47,19.3 90 top
IC1  27.05,29.46 0 top
IC2  53.09,29.46 90 top
IC3  39.12,65.02 0 top
IC4  39.12,52.83 0 top
IC6  71.12,51.31 0 top
IC7  31.75,75.69 0 top
IC8  41.4,73.15 90 top
IGNITER_BATT  60.71,75.95 180 top
L2  59.05,52.45 180 top
LEFT_HEADERS1  6.1,55.37 270 top
MOTOR  66.8,67.06 270 top
R1  30.73,33.27 0 top
R2  33.02,66.55 0 top
R3  34.8,81.41 180 top
R4  30.73,34.8 180 top
R6  66.8,39.88 0 top
R7  50.8,24.89 270 top
R8  54.1,24.89 270 top
R9  72.9,42.42 90 top
R11  57.15,30.99 0 top
R12  57.15,27.81 180 top
R13  57.15,29.34 180 top
R18  74.17,29.72 180 top
R19  70.61,29.72 180 top
R20  73.66,23.62 180 top
R21  70.36,23.62 180 top
R22  73.66,25.91 180 top
R23  57.15,24.51 180 top
R24  57.15,26.16 180 top
R25  70.36,25.91 180 top
R31  65.02,73.15 180 top
R32  53.59,74.8 270 top
RIGHT_HEADERS1  80.26,55.37 270 top
STRAT_BACKUP  11.94,36.83 270 top
STRAT_MAIN  77.22,37.59 270 top
U1  36.58,29.72 0 top
U2  19.3,30.48 270 top
U3  41.4,29.21 0 top
U7  53.09,33.66 180 top
U8  FDD8447L-F085CT-ND  [TO252']  59.56,67.06 180 top
U9  FDD8447L-F085CT-ND  [TO252']  51.31,65.02 180 top
U$1  43.18,29.21 0 top
U$36  STRATOLOGGER  [STRATOLOGGER]  45.54,10.9 270 top
U$38  20.4,10.9 270 top
X2  30.73,68.58 270 top

### Tracks (layer width: path | path; a pad name or v marks a point on that pad's centre or on a via)
5.0V  (via drill 0.35)
  Top 0.254: IC8.3 42.1,74.1 41.66,73.66 41.66,72.14 40.64,71.12 36.32,71.12 35.81,70.61 35.81,59.94 34.54,58.67 v34.54,52.32 | v34.54,48.01 8.89,48.01 LEFT_HEADERS1.8
  Bottom 0.254: LEFT_HEADERS1.8 7.37,46.48 7.37,27.69 14.73,20.32 23.88,20.32 BOTTOM_HEADER1.4 37.59,10.67 69.6,10.67 75.69,16.76 75.69,25.4 ENCODER1.4 80.77,26.92 85.09,31.24 85.09,42.93 RIGHT_HEADERS1.10 | v34.54,52.32 v34.54,48.01
+3V3  (via drill 0.35)
  Top 0.254: 29.88,34.54 R1.1 27.49,33.27 IC1.P$1 25.46,31.43 U2.5 | 29.88,34.54 R4.2 | C17.+ 45.22,74.28 C2.1 43.47,76.24 41.15,73.91 41.15,72.39 40.89,72.14 40.83,72.2 IC8.5 | IC8.5 40,72.3 C10.1 | 27.3,70.61 27.3,70.48 25.91,69.09 19.3,69.09 18.8,68.58 18.8,67.06 17.78,66.04 17.78,63.5 18.4,62.88 X2.4 21.45,62.88 v21.59,62.74 | 27.3,70.61 IC7.1 | 27.3,70.61 27.69,70.23 v27.69,69.34 | v33.27,67.82 33.87,67.22 R2.2 v35.05,66.55 | IC8.5 39.88,72.43 v39.88,73.15 | IC1.P$4 25.55,27.54 24.49,27.54 v23.88,26.92 | v29.21,36.32 29.21,35.22 29.88,34.54
  Bottom 0.254: v27.69,69.34 29.21,67.82 v33.27,67.82 | v39.88,73.15 39.88,71.37 v35.05,66.55 | v21.59,62.74 23.88,62.74 31.24,55.37 31.24,39.12 29.21,37.08 v29.21,36.32 29.21,32.26 v23.88,26.92
A_CHANNEL
  Top 0.254: R22.1 75.78,24.38 ENCODER1.3
ACC0  (via drill 0.35)
  Top 0.152: U1.5 35.83,27.44 35.56,27.18 34.29,27.18 32.26,29.21 32.26,32 v34.29,34.04 | v41.4,34.04 42.93,34.04 U$1.14/A0
  Top 0.254: U$1.14/A0 48.01,39.12 C5.1
  Bottom 0.152: v34.29,34.04 v41.4,34.04
ACC1  (via drill 0.35)
  Top 0.152: U1.4 33.52,28.97 33.02,29.46 33.02,31.24 v34.54,32.77 | v37.85,32.77 39.12,32.77 U$1.15/A1
  Top 0.254: U$1.15/A1 43.35,37 C4.1
  Bottom 0.152: v34.54,32.77 v37.85,32.77
ACC2
  Top 0.152: U1.16 35.83,32.02 U$1.16/A2
  Top 0.254: U$1.16/A2 39.46,38.01 C3.1
B_CHANNEL
  Top 0.254: R18.1 ENCODER1.5
BATT_IN  (via drill 0.35, 0.55)
  Top 0.305: 35.83,49.04 7.38,49.04 LEFT_HEADERS1.7 4.83,49.02 4.83,51.05 5.33,51.56 35.56,51.56
  Top 0.508: IC4.1 35.83,49.04 35.56,49.31 35.56,51.56 35.56,58.67 36.84,59.95 IC3.1
  Top 0.61: IC4.1 36.84,46.73 v38.61,44.96 | v55.63,40.64 56.9,41.91 C21.+
  Top 0.813: IC6.1 66.05,45.52 C23.2 64.2,45.53 v64.01,45.72 | v59.69,39.62 58.28,41.03 C21.+
  Bottom 0.61: v38.61,44.96 42.93,40.64 v55.63,40.64
  Bottom 0.813: v64.01,45.72 65.53,44.2 65.53,39.37 65.02,38.86 60.45,38.86 v59.69,39.62
C1
  Top 0.152: C13.1 49.56,28.39 49.63,28.32 51.18,28.32 51.25,28.39 IC2.24
CAP1
  Top 0.254: IC1.P$2 23.13,30.09 C1.1
CAP3
  Top 0.152: IC2.21 49.4,29.68 C14.1
CH_A  (via drill 0.35)
  Top 0.254: R22.2 R25.1 69.94,24.64 68.83,24.64 67.31,23.11 67.31,21.08 66.04,19.81 38.61,19.81 v38.1,20.32
  Bottom 0.254: v38.1,20.32 31.75,20.32 U$1.5
CH_B  (via drill 0.35)
  Top 0.254: R18.2 R19.1 70.45,28.7 67.56,28.7 64.77,25.91 64.77,21.08 64.01,20.32 39.62,20.32 v39.37,20.57 | v36.07,19.56 35.31,19.56 U$1.6
  Bottom 0.254: v39.37,20.57 38.35,19.56 v36.07,19.56
CH_X
  Top 0.254: R20.2 R21.1 69.85,22.26 69.85,20.83 68.33,19.3 37.85,19.3 U$1.7
CS_A/G
  Top 0.152: IC2.7 54.92,28.39 55.5,27.81 R12.2
CS_M
  Top 0.152: IC2.8 55.23,28.82 55.75,29.34 R13.2
D16_TX2
  Top 0.254: LEFT_HEADERS1.9 7.37,46.48 9.65,46.48 10.41,45.72 10.41,35.56 11.68,34.29 STRAT_BACKUP.2
D17_RX2
  Top 0.254: LEFT_HEADERS1.10 9.91,43.94 9.91,33.27 11.43,31.75 STRAT_BACKUP.3
D25  (via drill 0.35)
  Top 0.406: U8.G 61.87,73.15 R31.2 64.02,71.14 v64.01,71.12 | v76.2,59.94 80.26,55.88 RIGHT_HEADERS1.1
  Bottom 0.406: v64.01,71.12 64.01,62.23 66.29,59.94 v76.2,59.94
D26  (via drill 0.35)
  Top 0.406: U9.G 55.12,69.56 v55.12,69.09
  Top 0.61: U9.G R32.2
  Bottom 0.406: v55.12,69.09 65.79,58.42 81.28,58.42 82.8,56.9 RIGHT_HEADERS1.2
DEN_3V
  Top 0.152: IC2.13 54.33,30.99 R11.1
GND  (via drill 0.35)
  Top 0.152: v47.75,26.16 47.66,26.58 C13.2 | IC2.17 52.41,30.97 IC2.18
  Top 0.254: X2.6 21.28,65.08 v21.34,65.02 | v17.02,66.55 17.19,66.72 X2.MT1
  Bottom 0.152: C8.2 50.63,24.04 v47.75,26.16
  Bottom 0.254: v21.34,65.02 18.54,65.02 v17.02,66.55
  other vias: 52.32,24.04
  pour Top: 44.45,0 arc90 88.9,44.45 arc90 44.45,88.9 arc90 0,44.45 arc90
IGNITER_BATT
  Top 1.016: U9.D 53.34,65.83 U8.D 59.56,74.55 IGNITER_BATT.2
MISO  (via drill 0.35)
  Top 0.254: X2.7 21.2,66.18 v22.35,65.02
  Bottom 0.254: v22.35,65.02 31.75,55.63 31.75,31.24 36.83,26.16 45.47,26.16 48.26,23.37 U$1.12/MISO
MOSI  (via drill 0.35)
  Top 0.254: v32,70.36 32.38,70.74 IC7.5
  Bottom 0.254: U$1.11/MOSI 42.42,18.29 29.21,18.29 26.67,20.83 26.67,22.1 26.16,22.61 21.08,22.61 16.51,27.18 16.51,64.01 14.48,66.04 14.48,67.06 15.75,68.33 25.65,68.33 27.69,70.36 v32,70.36
MOTOR_SIGNAL  (via drill 0.35)
  Top 0.254: MOTOR.3 65.28,60.45 65.28,57.66 65.02,57.4 v65.02,48.77
  Bottom 0.254: v65.02,48.77 65.02,46.23 68.07,43.18 68.07,37.34 U$1.35/A16
N$1
  Top 0.254: ACT1.A 30.7,80.26 34.8,80.26 34.92,80.14 IC7.10
N$2
  Top 0.254: X2.5 24.1,63.98 28.57,68.45 IC7.2
N$4
  Top 0.254: X2.2 22.33,60.68 30.99,69.34 32.26,69.34 33.66,70.74 IC7.6 33.66,75.31 34.29,75.95 36.07,75.95 37.07,76.95 37.07,80.14 R3.1
N$5
  Top 0.254: R3.2 31.91,81.41 ACT1.C
N$6
  Top 0.254: X2.3 22.66,61.78 31.11,70.23 IC7.4
N$8
  Top 0.813: IC6.2 69.42,43.76 69.09,43.43 67.06,43.43 66.04,44.45 61.42,44.45 L2.1 51.77,47.45 50.8,46.48 45.44,46.48 D2.C
N$9
  Top 0.813: C24.2 61.4,43.43 65.28,43.43 66.8,41.91 R6.S R6.A 71.46,43.27 R9.2 72.9,45.44 IC6.4
N$36
  Top 0.152: U1.14 U1.15 36.33,31.75 36.7,32.13 40.26,32.13 40.34,32.21 | C12.1 39.62,28.7 40.45,29.53 U3.5 40.45,32.1 40.34,32.21 | 40.34,32.21 C6.1
REG_5V  (via drill 0.35)
  Top 0.152: 43.1,26.08 C9.1 42.93,26 C11.1 | 43.1,26.08 42.35,26.82 U3.3 42.35,28.51 41.66,29.21 41.15,29.21 40.45,28.51 U3.1 | IC4.2 41.4,45.97 40.89,45.47 40.89,39.12 v41.91,38.1 | v43.69,32.77 43.69,27.69 43.1,27.09 43.1,26.08
  Top 0.254: U2.1 18.61,31.43 19.3,30.73 19.3,30.23 18.61,29.53 U2.3 18,28.22 20.07,26.16 33.02,26.16 35.81,23.37 42.16,23.37 42.42,23.62 42.42,25.49 42.93,26 | v43.69,32.77 45.88,34.95 U7.3 52.14,34.48 52.83,33.78 53.34,33.78 54.04,34.48 U7.1 55.81,34.95 C7.1 | C18.1 44.65,72.2 IC8.1
  Top 0.406: IC8.1 42.7,60.68 44.45,58.93 44.45,51.09 IC4.2
  Bottom 0.152: v41.91,38.1 41.91,34.54 v43.69,32.77
SCK  (via drill 0.35)
  Top 0.254: IC7.9 36.2,76.83 36.07,76.71 31.24,76.71 29.97,75.44 29.97,74.17 | 29.97,74.17 29.97,72.75 IC7.3 | v46.99,39.37 46.99,44.2 v46.23,44.96 | v32.77,74.42 30.23,74.42 29.97,74.17
  Bottom 0.254: U$1.13/SCK 46.99,38.1 v46.99,39.37 | v46.23,44.96 46.23,69.09 40.89,74.42 v32.77,74.42
SCL_3.3V  (via drill 0.35)
  Top 0.152: IC2.2 52.44,27.55 51.82,26.92 51.31,26.92 50.8,26.42 R7.1
  Top 0.254: IC1.P$8 29.82,31.34 30.73,32.26 30.73,34.04 31.5,34.8 R4.1 33.02,36.23 U$1.19/A5/SCL
  Bottom 0.152: R7.1 49.44,25.74 48.01,27.18 37.34,27.18 33.02,31.5 U$1.19/A5/SCL
  other vias: 50.8,25.74
SDA_3.3V  (via drill 0.35)
  Top 0.152: R8.1 53.3,26.54 IC2.4
  Top 0.254: IC1.P$7 30.09,30.09 31.58,31.58 R1.2 32.51,33.27 33.27,34.04 33.27,34.8 35.31,36.83 U$1.18/A4/SDA
  Bottom 0.152: R8.1 52.24,25.74 51.56,26.42 49.78,26.42 48.51,27.69 37.34,27.69 33.53,31.5 33.53,34.8 U$1.18/A4/SDA
  other vias: 54.1,25.74
SDCD  (via drill 0.35)
  Top 0.254: R2.1 32.14,66.58 X2.CD1 29.24,66.58 v28.19,65.53
  Bottom 0.254: U$1.8 36.58,23.11 21.34,23.11 19.05,25.4 19.05,62.48 15.75,65.79 15.75,66.55 17.02,67.82 25.91,67.82 v28.19,65.53
SDCS  (via drill 0.35)
  Top 0.254: v24.13,61.47 v25.65,62.99 | v34.54,68.33 34.92,68.71 IC7.7
  Bottom 0.254: U$1.10/CS 41.15,23.62 23.37,23.62 22.86,24.13 22.86,26.16 21.59,27.43 21.59,58.93 v24.13,61.47 | v25.65,62.99 27.43,64.77 31.24,64.77 34.54,68.07 v34.54,68.33
SDO_AG
  Top 0.152: IC2.5 53.73,27.04 54.1,26.67 54.61,26.67 54.86,26.42 54.86,24.89 55.24,24.51 R23.2
SDO_M
  Top 0.152: IC2.6 54.36,27.91 54.36,27.43 54.61,27.18 54.86,27.18 55.88,26.16 R24.2
SOURCE2
  Top 1.016: DROGUE3.2 47.05,82.37 47.75,81.66 52.96,81.66 55.88,78.74 55.88,74.53 U8.S
SOURCE3  (via drill 0.65)
  Top 1.016: U9.S 49.03,72.02 50.67,73.66 v50.67,74.04
  Bottom 1.016: v50.67,74.04 52.7,76.07 52.7,80.26 51.31,81.66 40.13,81.66 39.17,82.62 DROGUE4.2
STRATM_RX
  Top 0.254: U$1.1/TX 23.11,18.8 68.58,18.8 70.36,20.57 78.49,20.57 78.99,21.34 78.99,33.27 STRAT_MAIN.2
STRATM_TX  (via drill 0.35)
  Top 0.254: U$1.0/RX 21.08,18.29 25.91,18.29 68.83,18.29 70.61,20.07 73.15,20.07 v73.66,19.56
  Bottom 0.254: v73.66,19.56 72.39,20.83 72.39,29.21 75.69,32.51 STRAT_MAIN.3
SW_MODE_SUPPLY  (via drill 0.55)
  Top 0.813: C24.1 64.2,41.21 R6.E | C22.+ 52.46,49.14 v52.58,49.02
  Top 1.016: C22.+ 48.51,51.82 54.15,57.45 L2.2 63.71,62.74 65.48,64.52 MOTOR.2
  Bottom 0.813: v52.58,49.02 60.45,41.15 R6.E
UC_SUPPLY
  Top 0.508: U$1.VIN 18.8,40.39 38.86,40.39 39.88,41.4 39.88,49.78 41.15,51.05 43.18,51.05 43.69,51.56 43.69,58.42 41.88,60.22 IC3.2
VDD  (via drill 0.35)
  Top 0.152: C8.1 52.32,26.67 52.87,27.22 IC2.3 | C8.1 50.8,24.22 R7.2 | C8.1 54.02,24.04 R8.2 54.1,23.62 53.34,22.86 49.53,22.86 49.28,23.11 49.28,26.67 50.55,26.67 51.18,27.3 51.69,27.3 51.87,27.48 IC2.1 50.82,27.96 v50.55,27.69 | v50.55,28.96 50.68,28.82 IC2.23 IC2.22 | v53.09,32 53.44,32.35 U7.5
  Top 0.254: R11.2 R13.1 R12.1 R24.1 R23.1 58,23.96 57.66,23.62 54.52,23.62 R8.2
  Bottom 0.152: v50.55,27.69 v50.55,28.96 51.69,28.96 53.09,30.23 v53.09,32
X_CHANNEL
  Top 0.254: R20.1 75.78,21.84 ENCODER1.2

### Text on the board
tPlace: GND | SUPPLY | SIGNAL | GND | GND | RX | RX | TX | TX | Flight Computer Deployment Board Rev. B | Longhorn Rocketry Association